# EAGLE design SimpleC64-128Cart-Dual (EAGLE 7.7.0)
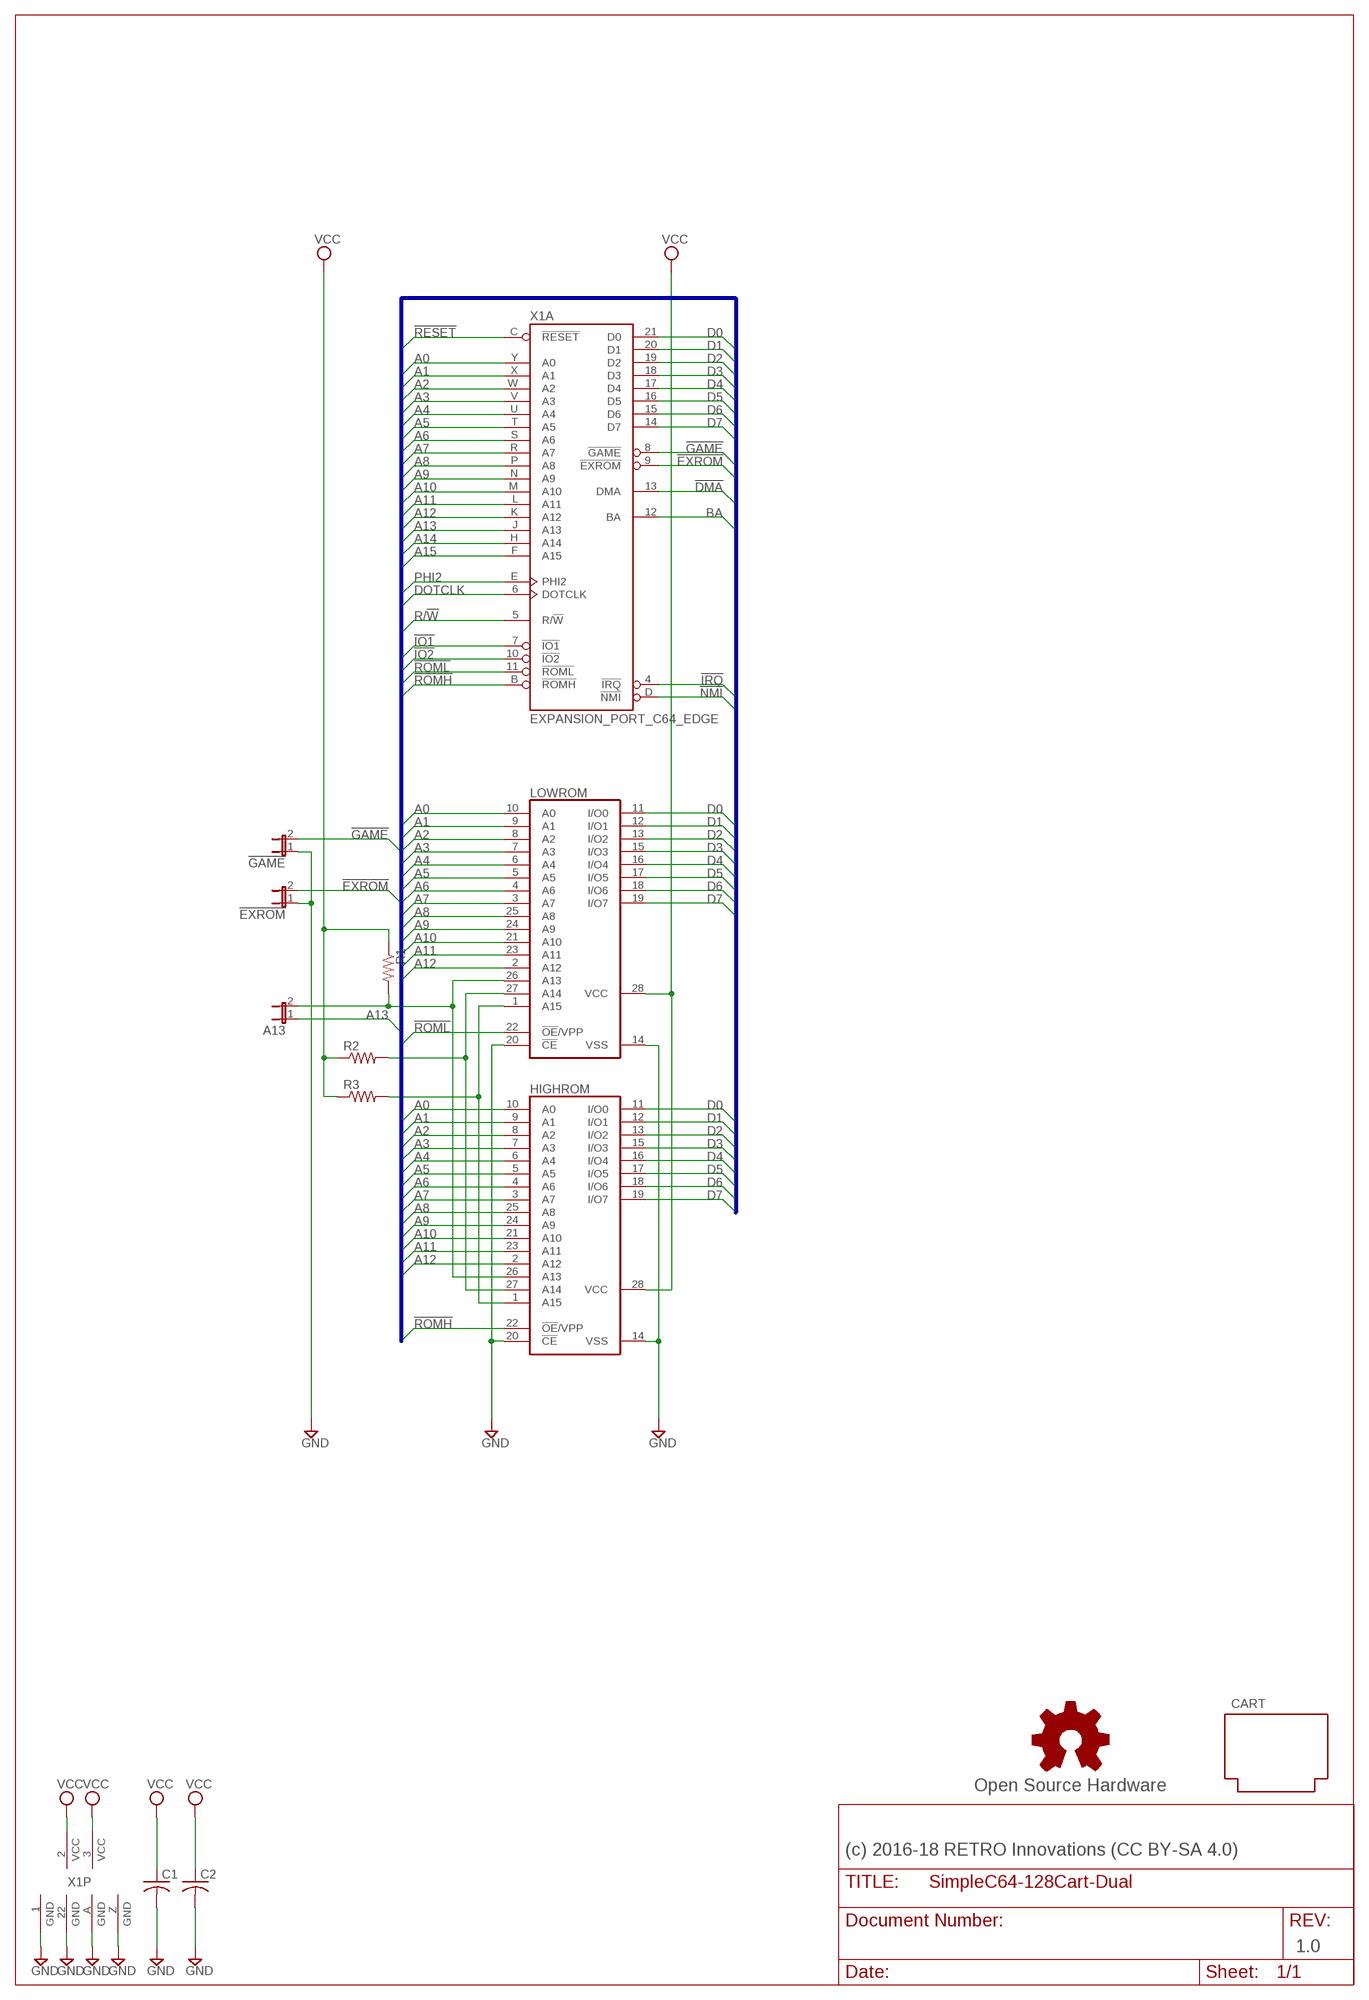
[diagram p0: schematic, sheet 1]

## Parts
!EXROM  JP1E  [JP1]
!GAME  JP1E  [JP1]
A13  JP1E  [JP1]
C1  C-US025-025X050  [C025-025X050]
C2  C-US025-025X050  [C025-025X050]
CART  CARTRIDGE_C64  [CARTRIDGE_C64]
GOLD_ORB_SM1  Open Source Hardware  OSHWLOGOLOGO8MM  [OSHW_8MM]
HIGHROM  27512G  [DIL28-6]
LOWROM  27512G  [DIL28-6]
R1  R-US_0204/7  [0204/7]
R2  R-US_0204/7  [0204/7]
R3  R-US_0204/7  [0204/7]
X1  EXPANSION_PORT_C64_EDGE  [MA100-22-2]

## Nets
!DMA: X1.13(A:DMA)
!EXROM: !EXROM.2 X1.9(A:!EXROM)
!GAME: !GAME.2 X1.8(A:!GAME)
!IO1: X1.7(A:!IO1)
!IO2: X1.10(A:!IO2)
!IRQ: X1.4(A:!IRQ)
!NMI: X1.D(A:!NMI)
!RESET: X1.C(A:!RESET)
!ROMH: HIGHROM.22(!OE!/VPP) X1.B(A:!ROMH)
!ROML: LOWROM.22(!OE!/VPP) X1.11(A:!ROML)
A0: HIGHROM.10(A0) LOWROM.10(A0) X1.Y(A:A0)
A1: HIGHROM.9(A1) LOWROM.9(A1) X1.X(A:A1)
A2: HIGHROM.8(A2) LOWROM.8(A2) X1.W(A:A2)
A3: HIGHROM.7(A3) LOWROM.7(A3) X1.V(A:A3)
A4: HIGHROM.6(A4) LOWROM.6(A4) X1.U(A:A4)
A5: HIGHROM.5(A5) LOWROM.5(A5) X1.T(A:A5)
A6: HIGHROM.4(A6) LOWROM.4(A6) X1.S(A:A6)
A7: HIGHROM.3(A7) LOWROM.3(A7) X1.R(A:A7)
A8: HIGHROM.25(A8) LOWROM.25(A8) X1.P(A:A8)
A9: HIGHROM.24(A9) LOWROM.24(A9) X1.N(A:A9)
A10: HIGHROM.21(A10) LOWROM.21(A10) X1.M(A:A10)
A11: HIGHROM.23(A11) LOWROM.23(A11) X1.L(A:A11)
A12: HIGHROM.2(A12) LOWROM.2(A12) X1.K(A:A12)
A13: A13.1 X1.J(A:A13)
A14: X1.H(A:A14)
A15: X1.F(A:A15)
ADDR13: A13.2 HIGHROM.26(A13) LOWROM.26(A13) R1.2
ADDR14: HIGHROM.27(A14) LOWROM.27(A14) R2.2
ADDR15: HIGHROM.1(A15) LOWROM.1(A15) R3.2
BA: X1.12(A:BA)
D0: HIGHROM.11(I/O0) LOWROM.11(I/O0) X1.21(A:D0)
D1: HIGHROM.12(I/O1) LOWROM.12(I/O1) X1.20(A:D1)
D2: HIGHROM.13(I/O2) LOWROM.13(I/O2) X1.19(A:D2)
D3: HIGHROM.15(I/O3) LOWROM.15(I/O3) X1.18(A:D3)
D4: HIGHROM.16(I/O4) LOWROM.16(I/O4) X1.17(A:D4)
D5: HIGHROM.17(I/O5) LOWROM.17(I/O5) X1.16(A:D5)
D6: HIGHROM.18(I/O6) LOWROM.18(I/O6) X1.15(A:D6)
D7: HIGHROM.19(I/O7) LOWROM.19(I/O7) X1.14(A:D7)
DOTCLK: X1.6(A:DOTCLK)
GND: !EXROM.1 !GAME.1 C1.2 C2.2 HIGHROM.14(VSS) HIGHROM.20(!CE) LOWROM.14(VSS) LOWROM.20(!CE) X1.1(P:GND) X1.22(P:GND) X1.A(P:GND) X1.Z(P:GND)
PHI2: X1.E(A:PHI2)
R/!W: X1.5(A:R/!W)
VCC: C1.1 C2.1 HIGHROM.28(VCC) LOWROM.28(VCC) R1.1 R2.1 R3.1 X1.2(P:VCC) X1.3(P:VCC)

## Buses
A[0..15],D[0..7],!IRQ,!NMI,BA,!DMA,DOTCLK,!IO1,!GAME,!EXROM,!IO2,!ROML,!ROMH,!RESET,PHI2,R/!W

## Notes on the sheet
- (c) 2016-18 RETRO Innovations (CC BY-SA 4.0)
- 1.0

## Library data of the parts
!EXROM !GAME A13 = jumper:JP1E: JUMPER
C1 C2 = rcl:C-US: CAPACITOR, American symbol
CART = commodore:CARTRIDGE_C64
GOLD_ORB_SM1 = oshw:OSHWLOGO: The OSHW logo for PCB layout
HIGHROM LOWROM = memory-hitachi:27512G: MEMORY; OC_FARNELL: unknown; OC_NEWARK: unknown
R1-R3 = rcl:R-US_: RESISTOR, American symbol
X1 = commodore:EXPANSION_PORT_C64_EDGE

## Board
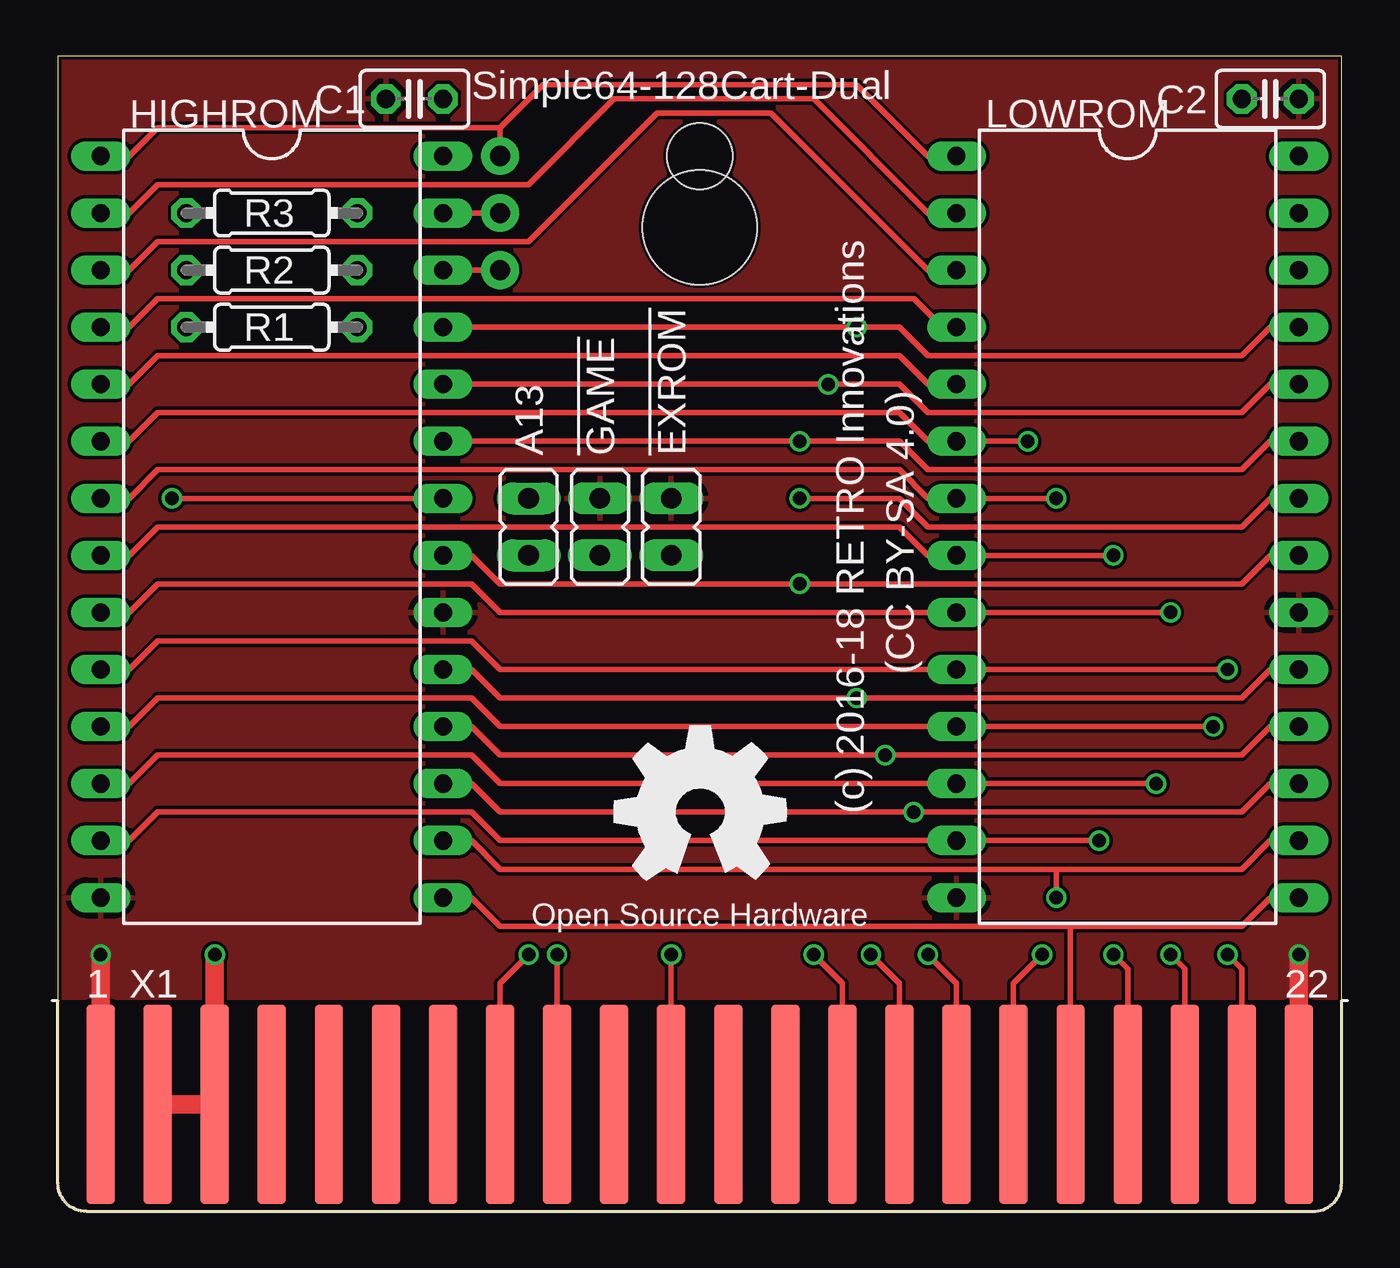
[diagram p1: board, top side]
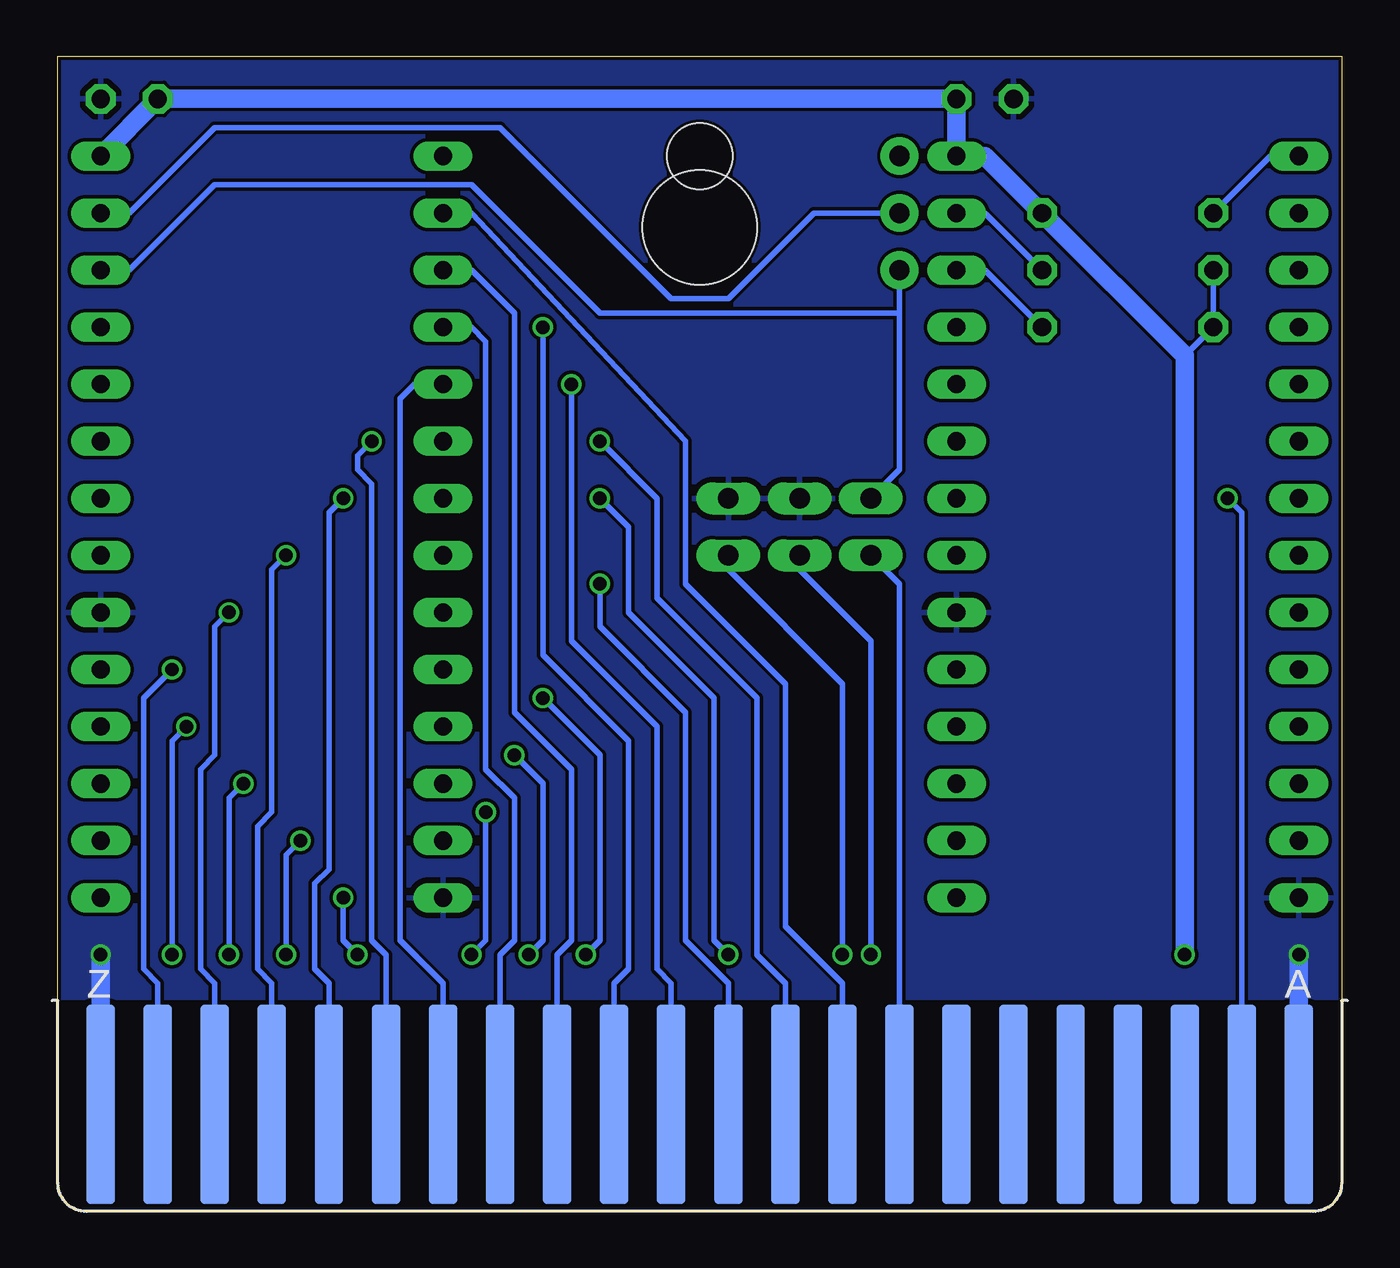
[diagram p2: board, bottom side, seen from below]

Size 57.15 x 51.43 mm. Coordinates in mm from the lower left corner, seen from the top.
Outline: 0,51.43 0,1.27 arc90 1.27,0 55.88,0 arc89 57.15,1.27 57.15,51.43 0,51.43
Copper layers (1*16): Top 0.035mm / dielectric 1.5mm / Bottom 0.035mm
Design rules "hackvana": minimum track width 6mil, minimum drill 0.3mm, track to track 6mil, track to pad 6mil, pad to pad 6mil, via to via 6mil, smd to smd 0mil, copper to edge 6mil, drill to drill 6mil, minimum pad ring 10mil, minimum via ring 6mil, stop-mask expansion 2mil, vias tented up to drill 100mil, thermal gap 10mil

### Footprints (pad centres in the part's own frame; a part is rotated, then mirrored left to right if it is on the bottom)
JP1 = drill 0.914 long: 1 0,-1.27; 2 0,1.27
C025-025X050 = drill 0.813 octagon: 1 -1.27,0; 2 1.27,0
CARTRIDGE_C64 = hole 5.08: 0,43.815 | hole 2.921: 0,46.99
DIL28-6 = drill 0.813 long: 1 -16.51,-7.62; 2 -13.97,-7.62; 3 -11.43,-7.62; 4 -8.89,-7.62; 5 -6.35,-7.62; 6 -3.81,-7.62; 7 -1.27,-7.62; 8 1.27,-7.62; 9 3.81,-7.62; 10 6.35,-7.62; 11 8.89,-7.62; 12 11.43,-7.62; 13 13.97,-7.62; 14 16.51,-7.62; 15 16.51,7.62; 16 13.97,7.62; 17 11.43,7.62; 18 8.89,7.62; 19 6.35,7.62; 20 3.81,7.62; 21 1.27,7.62; 22 -1.27,7.62; 23 -3.81,7.62; 24 -6.35,7.62; 25 -8.89,7.62; 26 -11.43,7.62; 27 -13.97,7.62; 28 -16.51,7.62
0204/7 = drill 0.813 octagon: 1 -3.81,0; 2 3.81,0
MA100-22-2 = smd 1.27 x 8.89: 1 -26.67,-0.305; 2 -24.13,-0.305; 3 -21.59,-0.305; 4 -19.05,-0.305; 5 -16.51,-0.305; 6 -13.97,-0.305; 7 -11.43,-0.305; 8 -8.89,-0.305; 9 -6.35,-0.305; 10 -3.81,-0.305; 11 -1.27,-0.305; 12 1.27,-0.305; 13 3.81,-0.305; 14 6.35,-0.305; 15 8.89,-0.305; 16 11.43,-0.305; 17 13.97,-0.305; 18 16.51,-0.305; 19 19.05,-0.305; 20 21.59,-0.305; 21 24.13,-0.305; 22 26.67,-0.305 | smd 1.27 x 8.89 bottom: A -26.67,-0.305; B -24.13,-0.305; C -21.59,-0.305; D -19.05,-0.305; E -16.51,-0.305; F -13.97,-0.305; H -11.43,-0.305; J -8.89,-0.305; K -6.35,-0.305; L -3.81,-0.305; M -1.27,-0.305; N 1.27,-0.305; P 3.81,-0.305; R 6.35,-0.305; S 8.89,-0.305; T 11.43,-0.305; U 13.97,-0.305; V 16.51,-0.305; W 19.05,-0.305; X 21.59,-0.305; Y 24.13,-0.305; Z 26.67,-0.305

### Placement (x,y rotation side)
!EXROM  27.3,30.48 180 top
!GAME  24.13,30.48 180 top
A13  20.95,30.48 0 top
C1  15.88,49.53 180 top
C2  53.97,49.53 0 top
CART  28.57,0 0 top
GOLD_ORB_SM1  28.57,17.78 0 top
HIGHROM  9.52,30.48 270 top
LOWROM  47.62,30.48 270 top
R1  9.52,39.37 0 top
R2  9.52,41.91 0 top
R3  9.52,44.45 180 top
X1  28.57,5.08 0 top

### Tracks (layer width: path | path; a pad name or v marks a point on that pad's centre or on a via)
!EXROM  (via drill 0.6)
  Top 0.254: X1.9 v22.23,11.43
  Bottom 0.254: v22.23,11.43 22.23,23.49 27.3,28.57 !EXROM.2
!GAME  (via drill 0.6)
  Top 0.254: v20.95,11.43 19.68,10.16 X1.8
  Bottom 0.254: v20.95,11.43 20.95,25.4 24.13,28.57 !GAME.2
!ROMH  (via drill 0.6)
  Top 0.254: v5.08,31.75 HIGHROM.22
  Bottom 0.254: v5.08,31.75 4.45,31.11 X1.B
!ROML  (via drill 0.6)
  Top 0.254: v33.02,31.75 37.47,31.75 38.73,30.48 52.7,30.48 53.97,31.75 LOWROM.22 | X1.11 v27.3,11.43
  Bottom 0.254: v27.3,11.43 27.94,12.06 27.94,22.86 31.75,26.67 31.75,30.48 v33.02,31.75
A0  (via drill 0.6)
  Top 0.254: HIGHROM.10 3.18,24.13 4.45,25.4 18.41,25.4 19.68,24.13 LOWROM.10 v52.07,24.13
  Bottom 0.254: v52.07,24.13 53.34,22.86 53.34,10.79 52.7,10.16 X1.Y
A1  (via drill 0.6)
  Top 0.254: HIGHROM.9 3.18,26.67 4.45,27.94 18.41,27.94 19.68,26.67 LOWROM.9 v49.53,26.67
  Bottom 0.254: v49.53,26.67 50.16,26.03 50.16,20.32 50.8,19.68 50.8,10.79 50.16,10.16 X1.X
A2  (via drill 0.6)
  Top 0.254: HIGHROM.8 3.18,29.21 4.45,30.48 37.47,30.48 38.73,29.21 LOWROM.8 v46.99,29.21
  Bottom 0.254: v46.99,29.21 47.62,28.57 47.62,17.78 48.26,17.14 48.26,10.79 47.62,10.16 X1.W
A3  (via drill 0.6)
  Top 0.254: HIGHROM.7 3.18,31.75 4.45,33.02 37.47,33.02 38.73,31.75 LOWROM.7 v44.45,31.75
  Bottom 0.254: v44.45,31.75 45.09,31.11 45.09,15.24 45.72,14.6 45.72,10.79 45.09,10.16 X1.V
A4  (via drill 0.6)
  Top 0.254: HIGHROM.6 3.18,34.29 4.45,35.56 37.47,35.56 38.73,34.29 LOWROM.6 v43.18,34.29
  Bottom 0.254: v43.18,34.29 43.81,33.66 43.81,33.02 43.18,32.38 43.18,12.06 42.55,11.43 X1.U
A5
  Top 0.254: HIGHROM.5 3.18,36.83 4.45,38.1 37.47,38.1 38.73,36.83 LOWROM.5
  Bottom 0.254: LOWROM.5 41.27,36.83 41.91,36.2 41.91,12.06 40,10.16 X1.T
A6
  Top 0.254: HIGHROM.4 3.18,39.37 4.45,40.64 38.1,40.64 39.37,39.37 LOWROM.4
  Bottom 0.254: LOWROM.4 38.73,39.37 38.1,38.73 38.1,19.68 36.83,18.41 36.83,12.06 37.47,11.43 X1.S
A7
  Top 0.254: HIGHROM.3 3.18,41.91 4.45,43.18 20.95,43.18 26.67,48.89 31.75,48.89 38.73,41.91 LOWROM.3
  Bottom 0.254: LOWROM.3 38.73,41.91 36.83,40 36.83,22.22 34.29,19.68 34.29,12.06 34.92,11.43 X1.R
A8  (via drill 0.6)
  Top 0.254: HIGHROM.25 v35.56,39.37 37.47,39.37 38.73,38.1 52.7,38.1 53.97,39.37 LOWROM.25
  Bottom 0.254: v35.56,39.37 35.56,24.76 31.75,20.95 31.75,10.79 32.38,10.16 X1.P
A9  (via drill 0.6)
  Top 0.254: HIGHROM.24 v34.29,36.83 37.47,36.83 38.73,35.56 52.7,35.56 53.97,36.83 LOWROM.24
  Bottom 0.254: v34.29,36.83 34.29,25.4 30.48,21.59 30.48,10.79 29.84,10.16 X1.N
A10  (via drill 0.6)
  Top 0.254: LOWROM.21 53.97,29.21 52.7,27.94 v33.02,27.94 19.68,27.94 18.41,29.21 HIGHROM.21
  Bottom 0.254: v33.02,27.94 33.02,26.03 29.21,22.22 29.21,12.06 27.3,10.16 X1.M
A11  (via drill 0.6)
  Top 0.254: LOWROM.23 53.97,34.29 52.7,33.02 38.73,33.02 37.47,34.29 v33.02,34.29 HIGHROM.23
  Bottom 0.254: v33.02,34.29 30.48,31.75 30.48,27.3 26.04,22.86 26.04,11.43 24.77,10.16 X1.L
A12
  Top 0.254: HIGHROM.2 3.18,44.45 4.45,45.72 20.95,45.72 24.77,49.53 33.66,49.53 38.73,44.45 LOWROM.2
  Bottom 0.254: LOWROM.2 38.73,44.45 29.21,34.29 29.21,27.94 24.77,23.49 24.77,12.7 22.23,10.16 X1.K
A13
  Bottom 0.254: A13.1 19.68,27.94 X1.J
ADDR13  (via drill 0.9 pad 1.68)
  Top 0.254: v19.68,41.91 HIGHROM.26
  Bottom 0.254: LOWROM.26 53.97,41.91 50.16,45.72 38.73,45.72 33.02,40 19.68,40 | R1.2 15.88,41.91 HIGHROM.26 | A13.2 19.68,33.02 19.68,40 | 19.68,40 v19.68,41.91
ADDR14  (via drill 0.9 pad 1.68)
  Top 0.254: HIGHROM.27 v19.68,44.45
  Bottom 0.254: LOWROM.27 53.97,44.45 50.16,48.26 37.47,48.26 29.84,40.64 27.3,40.64 23.49,44.45 v19.68,44.45 | R2.2 15.88,44.45 HIGHROM.27
ADDR15  (via drill 0.9 pad 1.68)
  Top 0.254: 19.68,48.26 4.45,48.26 3.18,46.99 HIGHROM.1 | 19.68,48.26 21.59,50.16 35.56,50.16 38.73,46.99 LOWROM.1 | v19.68,46.99 19.68,48.26
  Bottom 0.254: R3.2 3.18,46.99 HIGHROM.1
D0  (via drill 0.6)
  Top 0.254: HIGHROM.11 3.18,21.59 4.45,22.86 18.41,22.86 19.68,21.59 LOWROM.11 v51.44,21.59 | v52.07,11.43 52.7,10.79 X1.21
  Bottom 0.254: v52.07,11.43 52.07,20.95 v51.44,21.59
D1  (via drill 0.6)
  Top 0.254: HIGHROM.12 3.18,19.05 4.45,20.32 18.41,20.32 19.68,19.05 LOWROM.12 v48.89,19.05 | v49.53,11.43 50.16,10.79 X1.20
  Bottom 0.254: v49.53,11.43 49.53,18.41 v48.89,19.05
D2  (via drill 0.6)
  Top 0.254: HIGHROM.13 3.18,16.51 4.45,17.78 18.41,17.78 19.68,16.51 LOWROM.13 v46.36,16.51 | v46.99,11.43 47.62,10.79 X1.19
  Bottom 0.254: v46.99,11.43 46.99,15.87 v46.36,16.51
D3
  Top 0.254: HIGHROM.15 18.41,13.97 19.68,12.7 45.09,12.7 | 45.09,12.7 52.7,12.7 53.97,13.97 LOWROM.15 | X1.18 45.09,12.7
D4  (via drill 0.6)
  Top 0.254: HIGHROM.16 18.41,16.51 19.68,15.24 44.45,15.24 | v44.45,13.97 44.45,15.24 | 44.45,15.24 52.7,15.24 53.97,16.51 LOWROM.16 | v43.81,11.43 42.55,10.16 X1.17
  Bottom 0.254: v43.81,11.43 44.45,12.06 v44.45,13.97
D5  (via drill 0.6)
  Top 0.254: HIGHROM.17 18.41,19.05 19.68,17.78 v38.1,17.78 52.7,17.78 53.97,19.05 LOWROM.17 | v38.73,11.43 40,10.16 X1.16
  Bottom 0.254: v38.73,11.43 38.1,12.06 v38.1,17.78
D6  (via drill 0.6)
  Top 0.254: HIGHROM.18 18.41,21.59 19.68,20.32 v36.83,20.32 52.7,20.32 53.97,21.59 LOWROM.18 | v36.2,11.43 37.47,10.16 X1.15
  Bottom 0.254: v36.2,11.43 35.56,12.06 35.56,19.05 v36.83,20.32
D7  (via drill 0.6)
  Top 0.254: LOWROM.19 53.97,24.13 52.7,22.86 v35.56,22.86 19.68,22.86 18.41,24.13 HIGHROM.19 | v33.66,11.43 34.92,10.16 X1.14
  Bottom 0.254: v33.66,11.43 33.02,12.06 33.02,20.32 v35.56,22.86
GND  (via drill 0.6)
  Top 0.813: v1.9,11.43 X1.A | X1.Z v55.25,11.43
  Bottom 0.813: X1.A v1.9,11.43 | v55.25,11.43 X1.Z
  pour Top: 0,51.43 57.15,51.43 57.15,9.52 0,9.52
  pour Bottom: 0,51.43 0,9.52 57.15,9.52 57.15,51.43
VCC  (via drill 0.6)
  Top 0.813: X1.2 X1.3 v6.98,11.43
  Bottom 0.254: R2.1 R1.1 6.98,38.1
  Bottom 0.813: v6.98,11.43 6.98,38.1 R3.1 15.88,46.99 HIGHROM.28 C1.1 C2.1 LOWROM.28

### Text on the board
tPlace: Simple64-128Cart-Dual | (c) 2016-18 RETRO Innovations | (CC BY-SA 4.0)